# Altium schematic sheet DDR3.SchDoc
size A3; SheetNumber: 2; SheetTotal: 6
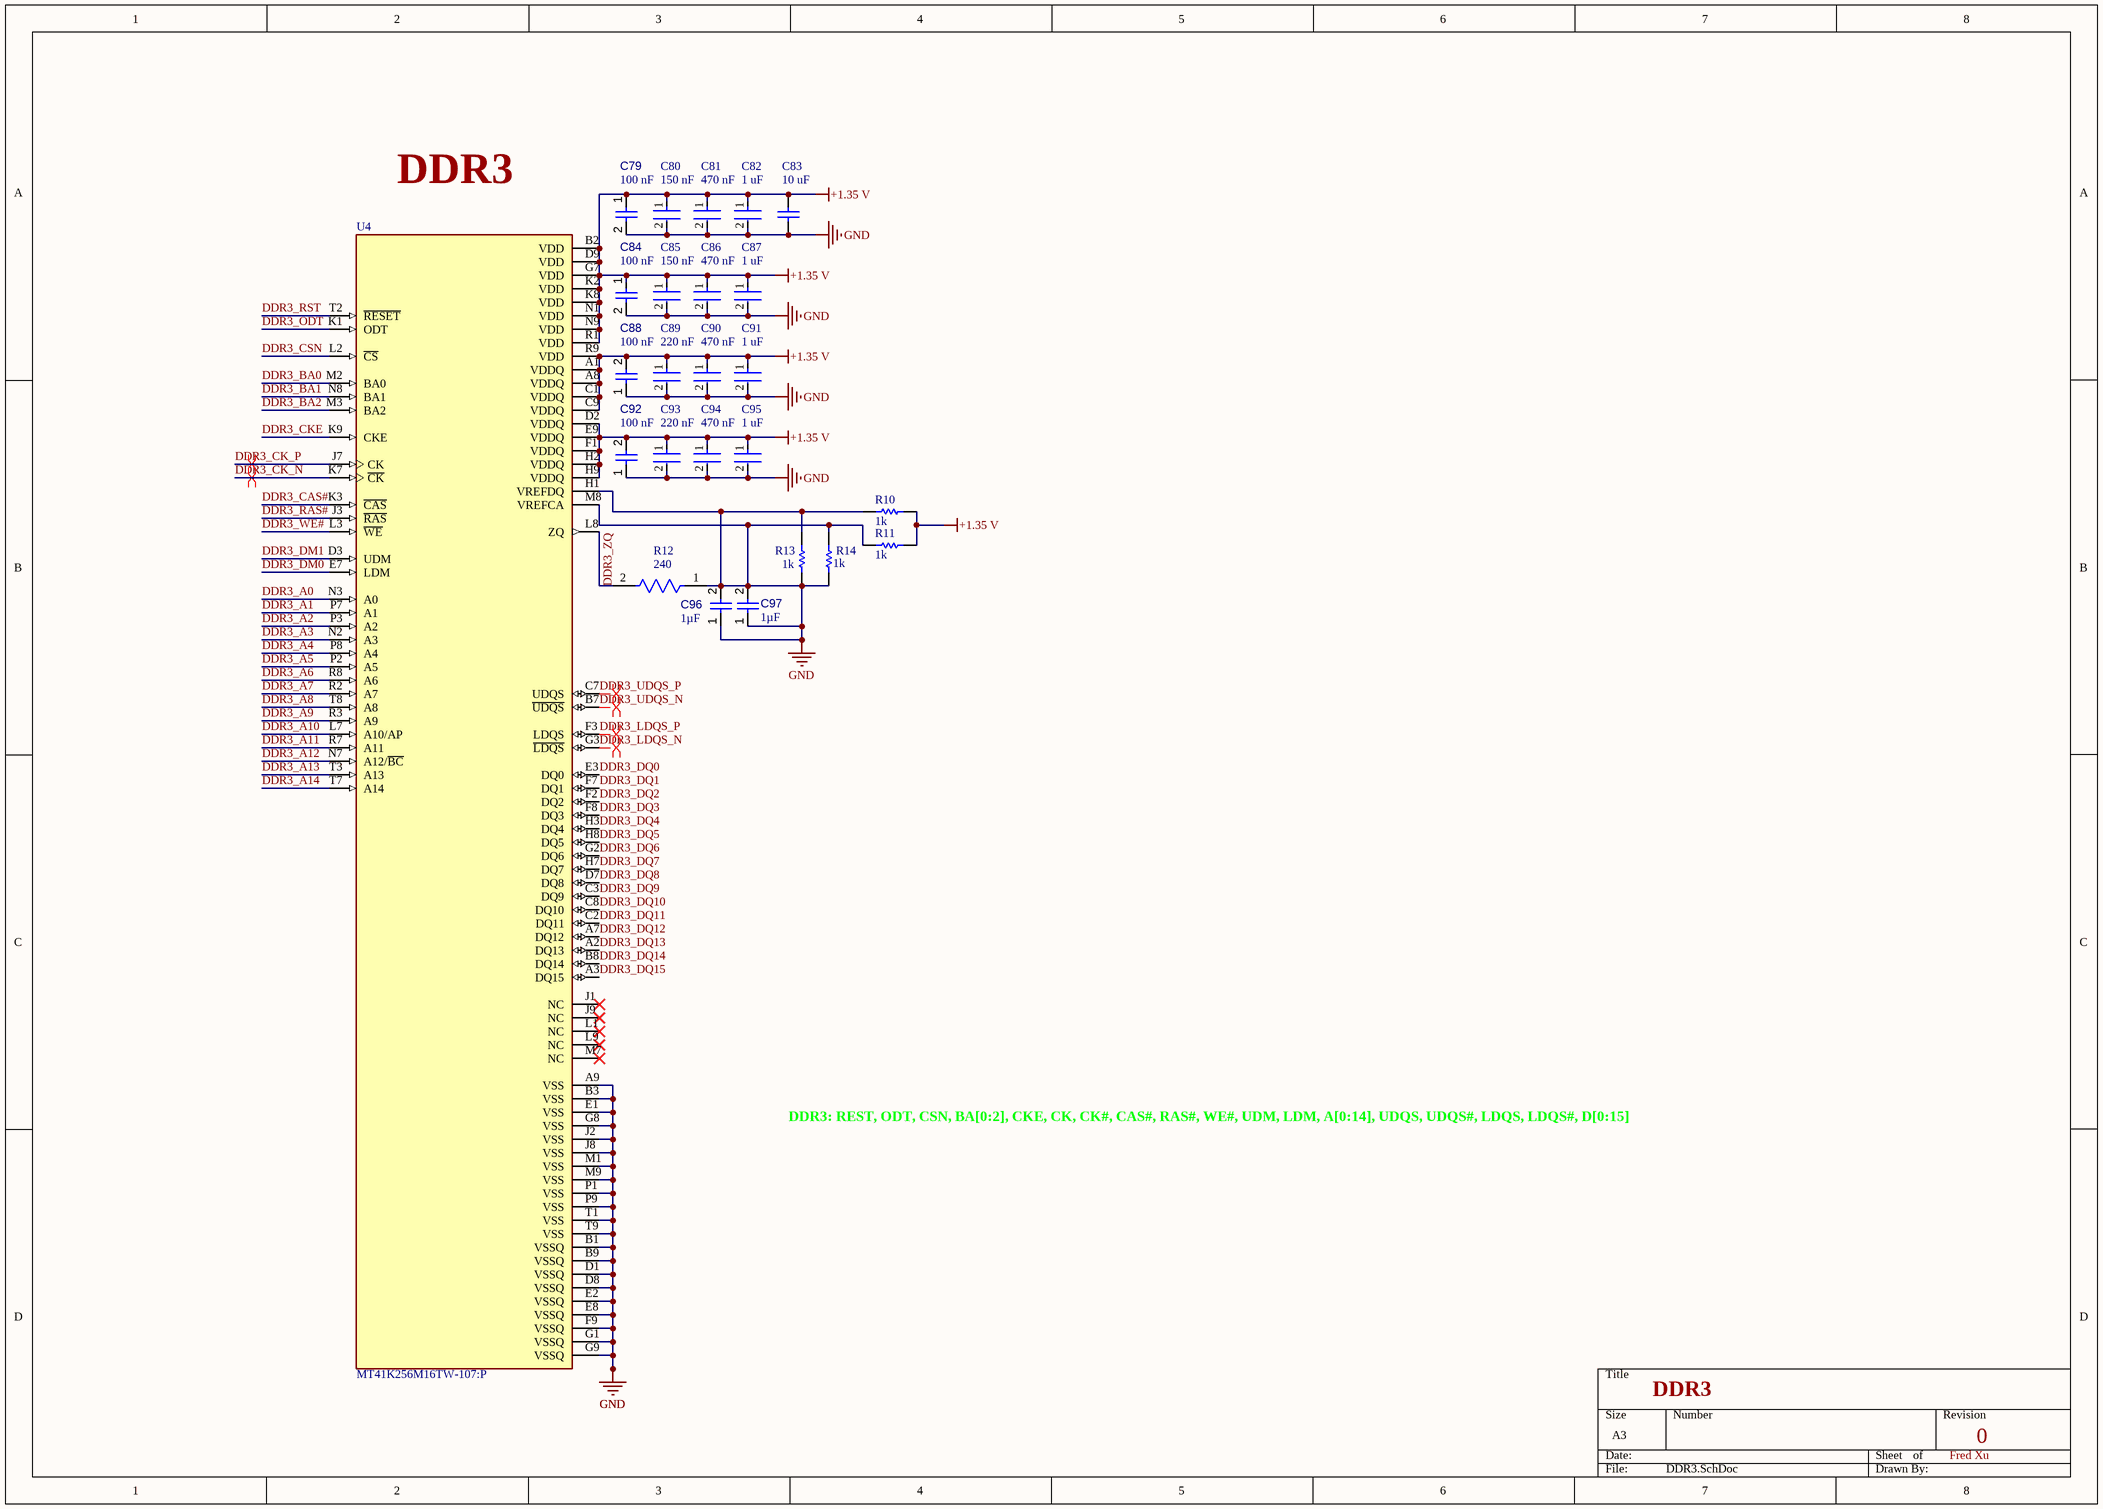
[diagram p0: DDR3.SchDoc]

## Parts
C79  value 100 nF  [CAPC1005X56X25LL10T15]  (hidden comment: 0.1 uF)
C80  150 nF  [FP-GCM155-0_05-MFG]
C81  470 nF  [FP-GRM155-0_05-IPC_B]
C82  1 uF  [FP-GCM155-0_2-MFG]
C83  10 uF  [CAPC2013X152X50NL20T25]
C84  value 100 nF  [CAPC1005X56X25LL10T15]  (hidden comment: 0.1 uF)
C85  150 nF  [FP-GCM155-0_05-MFG]
C86  470 nF  [FP-GRM155-0_05-IPC_B]
C87  1 uF  [FP-GCM155-0_2-MFG]
C88  value 100 nF  [CAPC1005X56X25LL10T15]  (hidden comment: 0.1 uF)
C89  220 nF  [FP-CGA2B-IPC_B]
C90  470 nF  [FP-GRM155-0_05-IPC_B]
C91  1 uF  [FP-GCM155-0_2-MFG]
C92  value 100 nF  [CAPC1005X56X25LL10T15]  (hidden comment: 0.1 uF)
C93  220 nF  [FP-CGA2B-IPC_B]
C94  470 nF  [FP-GRM155-0_05-IPC_B]
C95  1 uF  [FP-GCM155-0_2-MFG]
C96  value 1µF  [CAPC0603(1608)100_L]  (hidden comment: Capacitor 1µF +/-40% 50V 0603)
C97  value 1µF  [CAPC0603(1608)100_L]  (hidden comment: Capacitor 1µF +/-40% 50V 0603)
R10  1k  [RESC1005X40X25LL05T10]
R11  1k  [RESC1005X40X25LL05T10]
R12  240  [FP-RMCF0603-MFG]
R13  1k  [RESC1005X40X25LL05T10]
R14  1k  [RESC1005X40X25LL05T10]
U4  MT41K256M16TW-107:P  [BGA96C80P9X16_1400X800X120]

## Nets
+1.35 V: C79.1 C80.1 C81.1 C82.1 C83.2 C84.1 C85.1 C86.1 C87.1 C88.2 C89.1 C90.1 C91.1 C92.2 C93.1 C94.1 C95.1 R10.1 R11.1 U4.A1(VDDQ) U4.A8(VDDQ) U4.B2(VDD) U4.C1(VDDQ) U4.C9(VDDQ) U4.D2(VDDQ) U4.D9(VDD) U4.E9(VDDQ) U4.F1(VDDQ) U4.G7(VDD) U4.H2(VDDQ) U4.H9(VDDQ) U4.K2(VDD) U4.K8(VDD) U4.N1(VDD) U4.N9(VDD) U4.R1(VDD) U4.R9(VDD)
GND: C79.2 C80.2 C81.2 C82.2 C83.1 C84.2 C85.2 C86.2 C87.2 C88.1 C89.2 C90.2 C91.2 C92.1 C93.2 C94.2 C95.2 C96.1 C96.2 C97.1 C97.2 R10.2 R11.2 R12.1 R13.1 R13.2 R14.1 R14.2 U4.A9(VSS) U4.B1(VSSQ) U4.B3(VSS) U4.B9(VSSQ) U4.D1(VSSQ) U4.D8(VSSQ) U4.E1(VSS) U4.E2(VSSQ) U4.E8(VSSQ) U4.F9(VSSQ) U4.G1(VSSQ) U4.G8(VSS) U4.G9(VSSQ) U4.H1(VREFDQ) U4.J2(VSS) U4.J8(VSS) U4.M1(VSS) U4.M8(VREFCA) U4.M9(VSS) U4.P1(VSS) U4.P9(VSS) U4.T1(VSS) U4.T9(VSS)
DDR3_A0: U4.N3(A0)
DDR3_A1: U4.P7(A1)
DDR3_A2: U4.P3(A2)
DDR3_A3: U4.N2(A3)
DDR3_A4: U4.P8(A4)
DDR3_A5: U4.P2(A5)
DDR3_A6: U4.R8(A6)
DDR3_A7: U4.R2(A7)
DDR3_A8: U4.T8(A8)
DDR3_A9: U4.R3(A9)
DDR3_A10: U4.L7(A10/AP)
DDR3_A11: U4.R7(A11)
DDR3_A12: U4.N7(A12/~{BC})
DDR3_A13: U4.T3(A13)
DDR3_A14: U4.T7(A14)
DDR3_BA0: U4.M2(BA0)
DDR3_BA1: U4.N8(BA1)
DDR3_BA2: U4.M3(BA2)
DDR3_CAS#: U4.K3(~{CAS})
DDR3_CK_N: U4.K7(~{CK})
DDR3_CK_P: U4.J7(CK)
DDR3_CKE: U4.K9(CKE)
DDR3_CSN: U4.L2(~{CS})
DDR3_DM0: U4.E7(LDM)
DDR3_DM1: U4.D3(UDM)
DDR3_DQ0: U4.E3(DQ0)
DDR3_DQ1: U4.F7(DQ1)
DDR3_DQ2: U4.F2(DQ2)
DDR3_DQ3: U4.F8(DQ3)
DDR3_DQ4: U4.H3(DQ4)
DDR3_DQ5: U4.H8(DQ5)
DDR3_DQ6: U4.G2(DQ6)
DDR3_DQ7: U4.H7(DQ7)
DDR3_DQ8: U4.D7(DQ8)
DDR3_DQ9: U4.C3(DQ9)
DDR3_DQ10: U4.C8(DQ10)
DDR3_DQ11: U4.C2(DQ11)
DDR3_DQ12: U4.A7(DQ12)
DDR3_DQ13: U4.A2(DQ13)
DDR3_DQ14: U4.B8(DQ14)
DDR3_DQ15: U4.A3(DQ15)
DDR3_LDQS_N: U4.G3(~{LDQS})
DDR3_LDQS_P: U4.F3(LDQS)
DDR3_ODT: U4.K1(ODT)
DDR3_RAS#: U4.J3(~{RAS})
DDR3_RST: U4.T2(~{RESET})
DDR3_UDQS_N: U4.B7(~{UDQS})
DDR3_UDQS_P: U4.C7(UDQS)
DDR3_WE#: U4.L3(~{WE})
DDR3_ZQ: R12.2 U4.L8(ZQ)

Not connected (* = marked no-connect by the designer): U4 J1(NC)* J9(NC)* L1(NC)* L9(NC)* M7(NC)*

## Layout directives
differential pair: DDR3_CK_N, DDR3_CK_P, DDR3_LDQS_N, DDR3_LDQS_P, DDR3_UDQS_N, DDR3_UDQS_P

## Notes on the sheet
- DDR3
- DDR3: REST, ODT, CSN, BA[0:2], CKE, CK, CK#, CAS#, RAS#, WE#, UDM, LDM, A[0:14], UDQS, UDQS#, LDQS, LDQS#, D[0:15]
- Fred Xu
- 0

## Library data of the parts
C79 C84 C88 C92 = CMP-001-00001-6: Chip Capacitor, 0.1 uF, +/- 5%, 16 V, 0402 (1005 Metric); Capacitor Type: Ceramic; Voltage Rating: 16V; Max Operating Temperature: 125°C; Min Operating Temperature: -55°C; Case/Package: 0402; Mounting Technology: SM; Pins: 2; Tolerance: 5%; RoHS Compliant: True
C80 C85 = CMP-06035-038659-1: Ceramic Capacitor for Automotive 150nF ±20% 16VDC X7R 0402 Paper T/R
C81 C86 C90 C94 = CMP-06035-008909-1: Chip Multilayer Ceramic Capacitors for General Purpose, 0402, 0.47uF, X7R, 15%, 20%, 10V; Capacitance: 470nF; Length: 1mm; Thickness: 500um; Dielectric: X7R; Voltage Rating (DC): 10V; Width: 500um; Tolerance: 20%
C82 C87 C91 C95 = CMP-06035-019453-1: Ceramic Capacitor for Automotive 1uF ±20% 10VDC X7S 0402 Paper T/R
C83 = CMP-2007-04523-1: Part Number: 0805ZG106ZAT2A; Manufacturer: AVX Interconnect / Elco
C89 C93 = CMP-08246-001380-1: Cap Ceramic 220nF 25V X7R 20% Pad SMD 0402 +125°C Automotive T/R; Voltage Rating: 25V; Case Code (Imperial): 0402; Termination: SMD/SMT; Width: 0.02inch; Case Code (Metric): 1005; Length: 0.039inch; Min Operating Temperature: -55°C; Tolerance: 20%; Dielectric: X7R; Voltage Rating (DC): 25V; Capacitance: 220nF; Case/Package: 0402; Max Operating Temperature: 125°C; Ratings: AEC-Q200; Weight: 2.3E-05oz; Height: 0.5mm; Packaging: Tape and Reel; Package Quantity: 10000; Thickness: 0.022inch; Mount: Surface Mount
C96 C97 = CMP-001-00078-4: Chip Capacitor, 1µF +/-40%, 50V, 0603, Thickness 1 mm; Tolerance: 10%; Case/Package: 0603; Pins: 2; Max Operating Temperature: 85°C; Voltage Rating: 50V; Mounting Technology: SMT; Min Operating Temperature: -55°C
R10 R11 R13 R14 = CMP-2002-03045-1: Part Number: CRCW04021K00FKEDHP; Manufacturer: Vishay Dale
R12 = CMP-26527-002701-1: 240Ω ±1% 0.1W 0603 Thick Film Chip Resistor AEC-Q200 compliant; Max Power Dissipation: 100mW; Resistance: 240R; Temperature Coefficient: 100ppm/°C; Series: RMCF; Tolerance: 1%; Height: 0.022inch; Packaging: Tape and Reel; Min Operating Temperature: -55°C; Width: 0.031inch; Max Operating Temperature: 155°C; Features: Automotive AEC-Q200; Resistor Type: Thick Film; Mount: Surface Mount; Length: 0.061inch; RoHS Compliant: Yes; Number of Terminations: 2; Case/Package: 0603
U4 = CMP-011-000000-1: MF: {'manufacturer': u'Micron Technology Inc.'}; Source: MT41K256M16TW-107P.SchLib; Package: None; MP: MT41K256M16TW-107:P; Value: *; Availability: Unavailable; Price: None; Pin Count: 96; Design Item ID: MT41K256M16TW-107:P; Component Type: Standard